# EAGLE schematic ENGI301-Project2 (EAGLE 9.6.2)
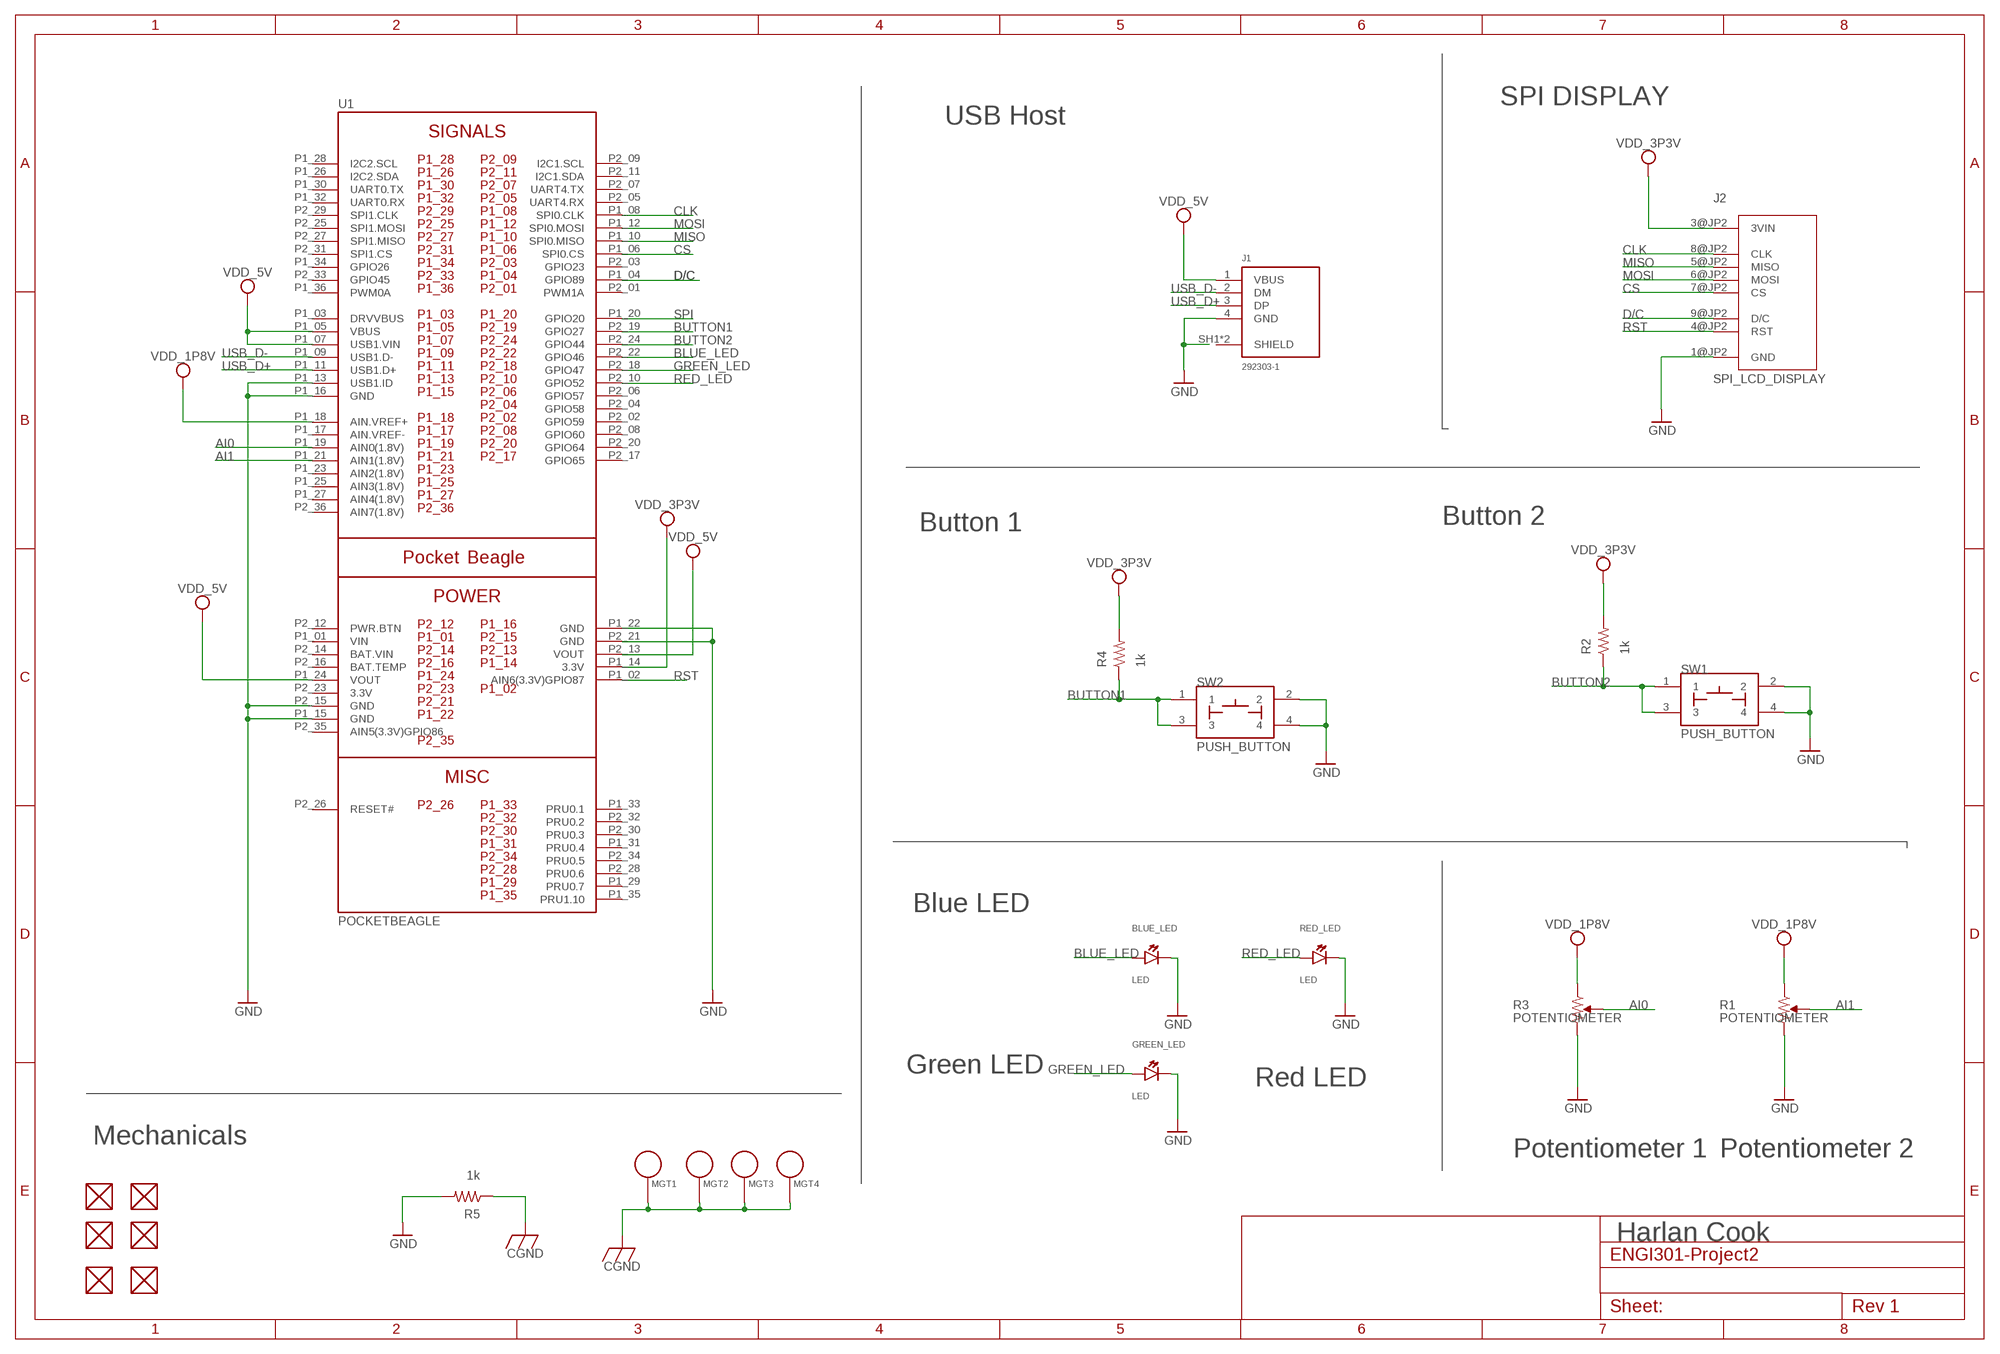
[diagram p0: schematic, sheet 1]

## Parts
BLUE_LED  LED  [EIA-STD]
FUD1  FIDUCIAL  [FIDUCIAL_40MIL]
FUD2  FIDUCIAL  [FIDUCIAL_40MIL]
FUD3  FIDUCIAL  [FIDUCIAL_40MIL]
FUD4  FIDUCIAL  [FIDUCIAL_40MIL]
FUD5  FIDUCIAL  [FIDUCIAL_40MIL]
FUD6  FIDUCIAL  [FIDUCIAL_40MIL]
GREEN_LED  LED  [EIA-STD]
J1  292303-1  [TE_292303-1]
J2  SPI_LCD_DISPLAY  [SPI_LCD_DISPLAY]
MGT1  MOUNTING_HOLE  [MOUNTING_HOLE]
MGT2  MOUNTING_HOLE  [MOUNTING_HOLE]
MGT3  MOUNTING_HOLE  [MOUNTING_HOLE]
MGT4  MOUNTING_HOLE  [MOUNTING_HOLE]
R1  POTENTIOMETER  [POT-PO90S]
R2  1k  R_R0402  [R0402]
R3  POTENTIOMETER  [POT-PO90S]
R4  1k  R_R0402  [R0402]
R5  1k  R_R0402  [R0402]
RED_LED  LED  [EIA-STD]
SW1  PUSH_BUTTON  [BUTTON_12.5MM]
SW2  PUSH_BUTTON  [BUTTON_12.5MM]
U1  POCKETBEAGLE  [POCKETBEAGLE]

## Nets
AI0: R3.S U1.P1_19(AIN0(1.8V))
AI1: R1.S U1.P1_21(AIN1(1.8V))
BLUE_LED: BLUE_LED.ANODE U1.P2_22(GPIO46)
BUTTON1: R4.1 SW2.1 SW2.3 U1.P2_19(GPIO27)
BUTTON2: R2.1 SW1.1 SW1.3 U1.P2_24(GPIO44)
CGND: MGT1.P$1 MGT2.P$1 MGT3.P$1 MGT4.P$1 R5.1
CLK: J2.8@JP2(CLK) U1.P1_08(SPI0.CLK)
CS: J2.7@JP2(CS) U1.P1_06(SPI0.CS)
D/C: J2.9@JP2(D/C) U1.P1_04(GPIO89)
GND: BLUE_LED.CATHODE GREEN_LED.CATHODE J1.4(GND) J2.1@JP2(GND) R1.CW R3.CW R5.2 RED_LED.CATHODE SW1.2 SW1.4 SW2.2 SW2.4 U1.P1_13(USB1.ID) U1.P1_15(GND) U1.P1_16(GND) U1.P1_22(GND) U1.P2_15(GND) U1.P2_21(GND)
GREEN_LED: GREEN_LED.ANODE U1.P2_18(GPIO47)
MISO: J2.5@JP2(MISO) U1.P1_10(SPI0.MISO)
MOSI: J2.6@JP2(MOSI) U1.P1_12(SPI0.MOSI)
RED_LED: RED_LED.ANODE U1.P2_10(GPIO52)
RST: J2.4@JP2(RST) U1.P1_02(AIN6(3.3V)GPIO87)
SPI: U1.P1_20(GPIO20)
USB_D+: J1.3(DP) U1.P1_11(USB1.D+)
USB_D-: J1.2(DM) U1.P1_09(USB1.D-)
VDD_1P8V: R1.CCW R3.CCW U1.P1_18(AIN.VREF+)
VDD_3P3V: J2.3@JP2(3VIN) R2.2 R4.2 U1.P1_14(3.3V)
VDD_5V: J1.1(VBUS) U1.P1_05(VBUS) U1.P1_07(USB1.VIN) U1.P1_24(VOUT) U1.P2_13(VOUT)
Unconnected: FUD1.P$1 FUD2.P$1 FUD3.P$1 FUD4.P$1 FUD5.P$1 FUD6.P$1 J1.SH1(SHIELD) J1.SH2(SHIELD) U1.P1_03(DRVVBUS) U1.P1_17(AIN.VREF-) U1.P1_23(AIN2(1.8V)) U1.P1_25(AIN3(1.8V)) U1.P1_26(I2C2.SDA) U1.P1_27(AIN4(1.8V)) U1.P1_28(I2C2.SCL) U1.P1_29(PRU0.7) U1.P1_30(UART0.TX) U1.P1_31(PRU0.4) U1.P1_32(UART0.RX) U1.P1_33(PRU0.1) U1.P1_34(GPIO26) U1.P1_35(PRU1.10) U1.P1_36(PWM0A) U1.P2_01(PWM1A) U1.P2_02(GPIO59) U1.P2_03(GPIO23) U1.P2_04(GPIO58) U1.P2_05(UART4.RX) U1.P2_06(GPIO57) U1.P2_07(UART4.TX) U1.P2_08(GPIO60) U1.P2_09(I2C1.SCL) U1.P2_11(I2C1.SDA) U1.P2_12(PWR.BTN) U1.P2_16(BAT.TEMP) U1.P2_17(GPIO65) U1.P2_20(GPIO64) U1.P2_25(SPI1.MOSI) U1.P2_26(RESET#) U1.P2_27(SPI1.MISO) U1.P2_28(PRU0.6) U1.P2_29(SPI1.CLK) U1.P2_30(PRU0.3) U1.P2_31(SPI1.CS) U1.P2_32(PRU0.2) U1.P2_33(GPIO45) U1.P2_34(PRU0.5) U1.P2_35(AIN5(3.3V)GPIO86) U1.P2_36(AIN7(1.8V))

## Notes on the sheet
- SPI DISPLAY
- USB Host
- Button 1 | Button 2
- Blue LED
- Green LED
- Red LED
- Mechanicals
- Potentiometer 1 | Potentiometer 2
- Harlan Cook

## Power pins joined to a net without a drawn wire
3.3V: U1.P2_23(3.3V)
BAT.VIN: U1.P2_14(BAT.VIN)
VIN: U1.P1_01(VIN)

## Library data of the parts
BLUE_LED GREEN_LED RED_LED = ENGI301-Project2:LED: EIA-STD LED, LTST-C191TBKT
FUD1-FUD6 = ENGI301-Project2:FIDUCIAL
J1 = ENGI301-Project2:292303-1: CONN USB RECEPT R/A TYPE A 4POS Check prices <https://pricing.snapeda.com/parts/292303-1/TE%20Connectivity/view-part?ref=eda>; AVAILABILITY: In Stock; COMMENT: 292303-1; DESCRIPTION: Conn; Data; USB; Recept; 2.0; 4 Pos; 1 Port; Rt Angle; A Ser; Tin over Copper; MF: TE Connectivity; MP: 292303-1; PACKAGE: None; PRICE: None; PURCHASE-URL: https://pricing.snapeda.com/search/part/292303-1/?ref=eda
J2 = ENGI301-Project2:SPI_LCD_DISPLAY
MGT1-MGT4 = ENGI301-Project2:MOUNTING_HOLE: Chassis Mounting Hole w/GND connection ability
R1 R3 = ENGI301-Project2:POTENTIOMETER: Potentiometer - Examples: P090S-14T20BR10K (987-1277-ND)
R2 R4 R5 = ENGI301-Project2:R_: RESISTOR, American symbol
SW1 SW2 = ENGI301-Project2:PUSH_BUTTON
U1 = ENGI301-Project2:POCKETBEAGLE